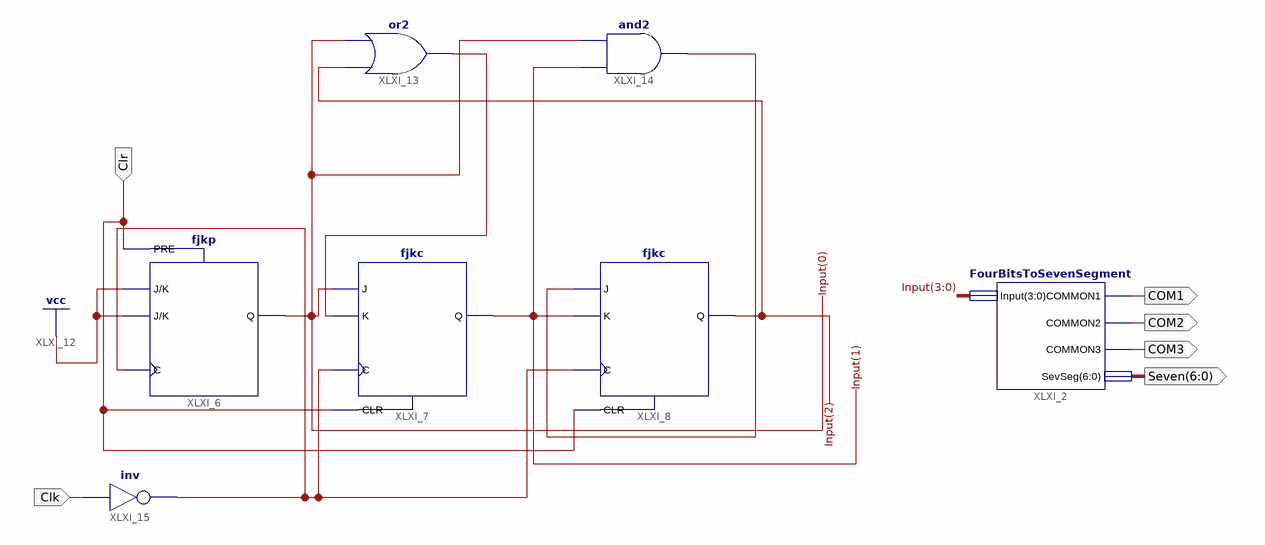
[diagram p0: schematic sheet 1]
// Xilinx ISE schematic Counter.sch (spartan6) as structural Verilog: 7 symbols, 6 ports
module Counter (
  input  Clr,
  input  Clk,
  output COM1,
  output COM2,
  output COM3,
  output [6:0] Seven
);

  wire XLXN_42, XLXN_45, XLXN_49;
  wire [3:0] Input;

  fjkp XLXI_6 (.C(XLXN_49), .J(1'b1), .K(1'b1), .PRE(Clr), .Q(Input[0]));
  fjkc XLXI_7 (.C(XLXN_49), .CLR(Clr), .J(Input[0]), .K(XLXN_42), .Q(Input[1]));
  fjkc XLXI_8 (.C(XLXN_49), .CLR(Clr), .J(XLXN_45), .K(Input[1]), .Q(Input[2]));
  FourBitsToSevenSegment XLXI_2 (.Input(Input), .COMMON1(COM1), .COMMON2(COM2), .COMMON3(COM3), .SevSeg(Seven));
  or XLXI_13 (XLXN_42, Input[2], Input[0]);
  and XLXI_14 (XLXN_45, Input[1], Input[0]);
  not XLXI_15 (XLXN_49, Clk);

  // Notes on the sheet:
  //   LOC on signal Clr = P46
  //   LOC on signal Clk = P45
endmodule
